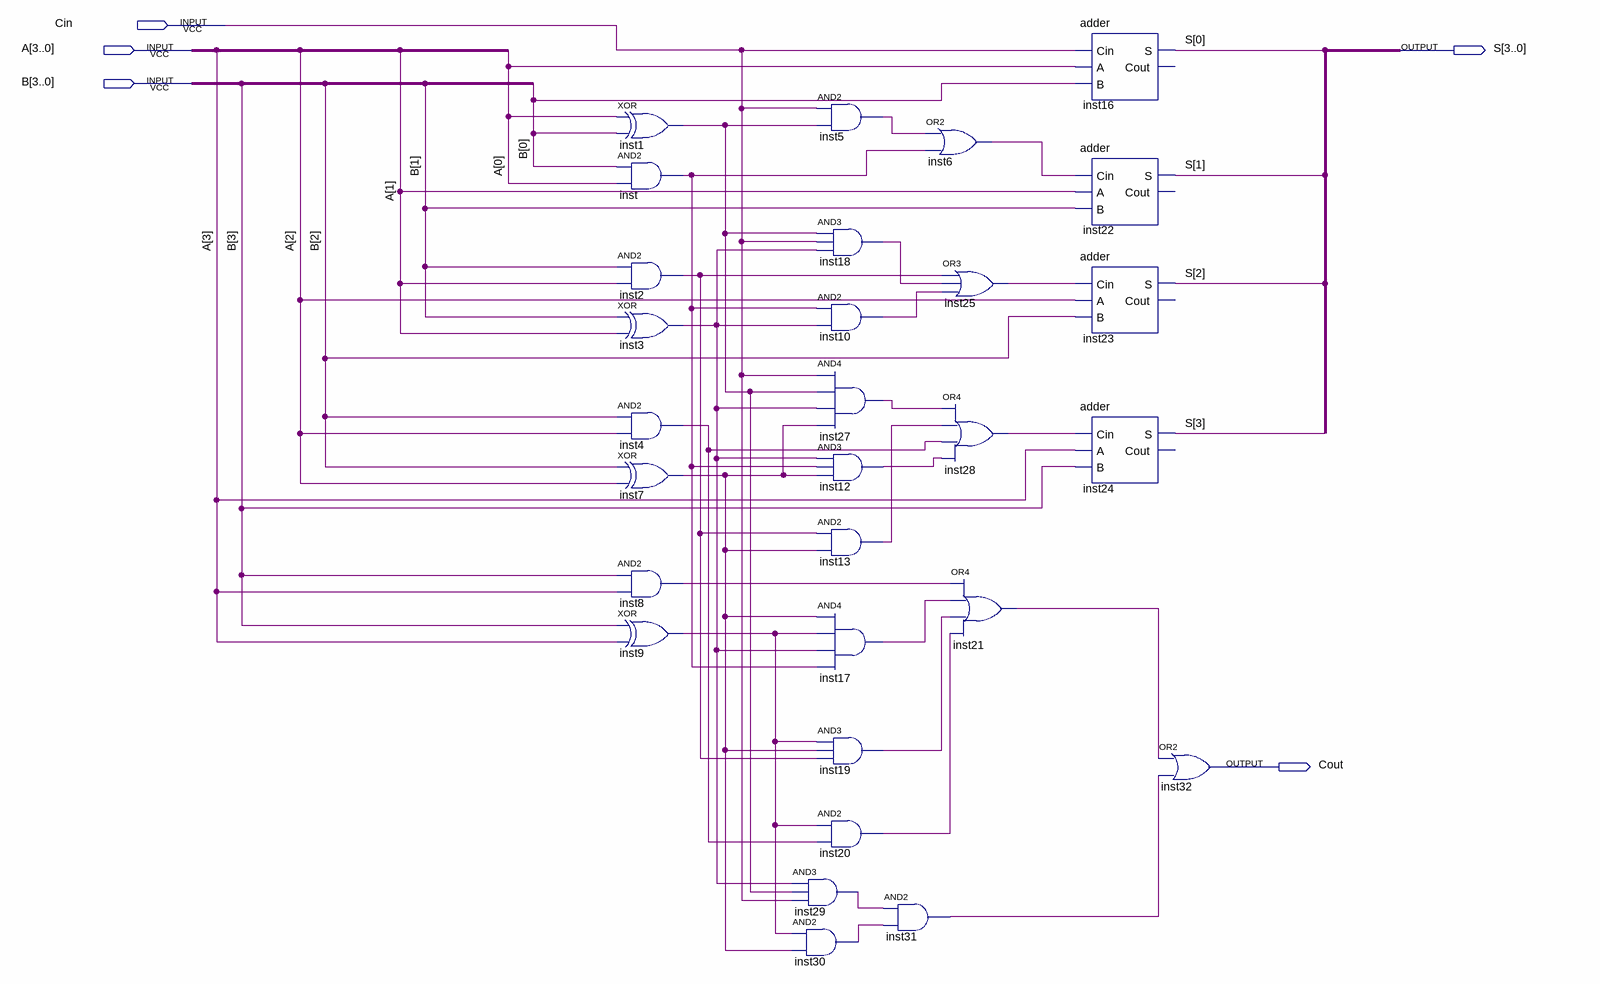
[diagram p0: schematic sheet]
// Quartus schematic fourbitsadder.bdf as structural Verilog: 29 symbols, 5 pins
module fourbitsadder (
  input  Cin,
  input  [3:0] A,
  input  [3:0] B,
  output [3:0] S,
  output Cout
);

  wire inst1_out, inst2_out, inst3_out, inst4_out, inst5_out, inst6_out, inst7_out, inst8_out, inst9_out,
       inst10_out, inst12_out, inst13_out, inst17_out, inst18_out, inst19_out, inst20_out, inst21_out,
       inst25_out, inst27_out, inst28_out, inst29_out, inst30_out, inst31_out, inst_out;

  xor inst1 (inst1_out, A[0], B[0]);
  and inst (inst_out, B[0], A[0]);
  and inst2 (inst2_out, B[1], A[1]);
  xor inst3 (inst3_out, B[1], A[1]);
  and inst4 (inst4_out, B[2], A[2]);
  xor inst7 (inst7_out, B[2], A[2]);
  and inst8 (inst8_out, B[3], A[3]);
  xor inst9 (inst9_out, B[3], A[3]);
  and inst5 (inst5_out, Cin, inst1_out);
  and inst18 (inst18_out, inst1_out, Cin, inst3_out);
  and inst10 (inst10_out, inst_out, inst3_out);
  and inst27 (inst27_out, Cin, inst1_out, inst3_out, inst7_out);
  and inst12 (inst12_out, inst3_out, inst_out, inst7_out);
  and inst13 (inst13_out, inst2_out, inst7_out);
  and inst17 (inst17_out, inst7_out, inst9_out, inst3_out, inst_out);
  and inst19 (inst19_out, inst9_out, inst7_out, inst2_out);
  and inst20 (inst20_out, inst9_out, inst4_out);
  and inst29 (inst29_out, inst3_out, inst1_out, Cin);
  and inst30 (inst30_out, inst9_out, inst7_out);
  and inst31 (inst31_out, inst29_out, inst30_out);
  or inst6 (inst6_out, inst5_out, inst_out);
  or inst25 (inst25_out, inst2_out, inst18_out, inst10_out);
  or inst28 (inst28_out, inst27_out, inst13_out, inst4_out, inst12_out);
  or inst21 (inst21_out, inst8_out, inst17_out, inst19_out, inst20_out);
  adder inst16 (.Cin(Cin), .A(A[0]), .B(B[0]), .S(S[0]));  // open: Cout
  adder inst22 (.Cin(inst6_out), .A(A[1]), .B(B[1]), .S(S[1]));  // open: Cout
  adder inst23 (.Cin(inst25_out), .A(A[2]), .B(B[2]), .S(S[2]));  // open: Cout
  adder inst24 (.Cin(inst28_out), .A(A[3]), .B(B[3]), .S(S[3]));  // open: Cout
  or inst32 (Cout, inst21_out, inst31_out);
endmodule
